# Altium schematic sheet PowerInput.SchDoc
size A; SheetNumber: 2; SheetTotal: 7
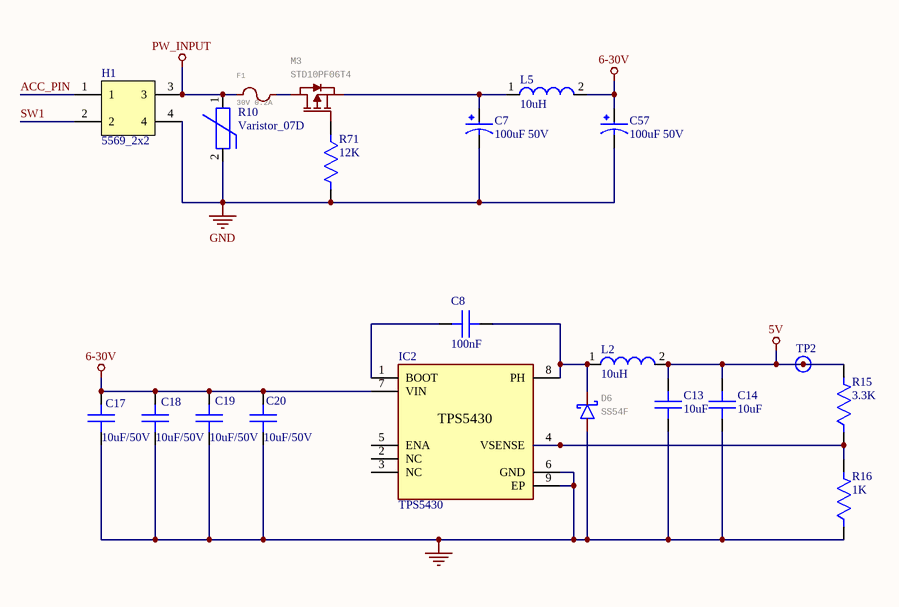
[diagram p0: PowerInput.SchDoc]

## Parts
C7  100uF 50V  [CAP_AL_8x12.5]
C8  100nF  [C0603]
C13  10uF  [C0805]
C14  10uF  [C0805]
C17  10uF/50V  [C0805]
C18  10uF/50V  [C0805]
C19  10uF/50V  [C0805]
C20  10uF/50V  [C0805]
C57  100uF 50V  [CAP_AL_8x12.5]
D6  SS54F  [SMAF]
F1  30V 0.2A  [FUSE_MF-MSMF150]
H1  5569_2x2  [5569_2x2]
IC2  TPS5430  [SOIC-8E]
L2  10uH  [L0630]
L5  10uH  [L0630]
M3  STD10PF06T4  [TO252-3]
R10  Varistor_07D  [Varistor_07D]
R15  3.3K  [R0603]
R16  1K  [R0603]
R71  12K  [R0603]
TP2  TestPoint_1MM  [TestPoint_1MM]  (value not drawn)

## Nets
5V: C13.1 C14.1 L2.2 R15.2 TP2.1
6-30V: C17.1 C18.1 C19.1 C20.1 C57.1 IC2.7(VIN) L5.2
GND: C7.2 C13.2 C14.2 C17.2 C18.2 C19.2 C20.2 C57.2 D6.A H1.4 IC2.6(GND) IC2.9(EP) R10.2 R16.1 R71.2
PW_INPUT: F1.1 H1.3 R10.1
ACC_PIN: H1.1
SW1: H1.2
NetC7_1: C7.1 L5.1 M3.2(S)
NetC8_1: C8.1 IC2.1(BOOT)
NetC8_2: C8.2 D6.C IC2.8(PH) L2.1
NetF1_2: F1.2 M3.3(D)
NetIC2_4: IC2.4(VSENSE) R15.1 R16.2
NetM3_1: M3.1(G) R71.1

Not connected (* = marked no-connect by the designer): IC2 2(NC) 3(NC) 5(ENA)

## Library data of the parts
C7 C57 = CAP_AL_8x12.5: Aluminum Electrolytic Capacitors - Radial Leaded 50VDC 1200uF 10000H 16x25mm; MF: Panasonic; MP: EEU-FS1H122; Price: None; Value: *; Availability: In Stock; Check_prices: https://www.snapeda.com/parts/EEU-FS1H122/Panasonic/view-part/?ref=eda; Purchase-URL: https://pricing.snapeda.com/search/part/EEU-FS1H122/?ref=eda; SnapEDA_Link: https://www.snapeda.com/parts/EEU-FS1H122/Panasonic/view-part/?ref=snap; Package: RADIAL-2 Panasonic
C8 = Capacitor
C13 C14 C17-C20 = Capacitor 0805
D6 = SS54F: GateName_1: G$1; SymbolName_1: DIODE_S; LibraryName: Uy_SMD; DeviceSetName: SS54F; Package: SMAF
F1 = FUSE_MF-MSMF150: GateName_1: G$1; MF: Bourns; SymbolName_1: MF-MSMF150; LibraryName: Uy_SMD; DeviceSetName: MF-MSMF150; Package: FUSER_MF-MSMF150; AVAILABILITY: Unavailable; MP: MF-MSMF150; PACKAGE: None; PRICE: None
IC2 = TPS5430: Buck Step-Down Converter / (5.5V to 36V Input, 3A); MF: Texas Instruments; MP: TPS5430DDA; Availability: Unavailable; Value: *; Mouser-Purchase-URL: https://snapeda.com/shop?store=Mouser&id=226174; Texas_Instruments-Purchase-URL: https://snapeda.com/shop?store=Texas+Instruments&id=226174; Package: HSOIC-8 Texas Instruments; DigiKey-Purchase-URL: https://snapeda.com/shop?store=DigiKey&id=226174; Price: None; SnapEDA_Link: https://www.snapeda.com/parts/TPS5430DDA/Texas%20Instruments/view-part/226174/?ref=snap
L2 L5 = Inductor 0630: HIGH POWER INDUCTOR 1040; MF: Wurth Electronics; MP: 74437368047; Value: *; Price: None; Package: Nonstandard Wurth Electronics; SnapEDA_Link: https://www.snapeda.com/parts/74437368047/Wurth%20Electronics%20Inc./view-part/286863/?ref=snap; Availability: Unavailable
M3 = MOSFETP_TO252: SOT-23; GateName_1: G$1; SymbolName_1: MOSFET_N; DeviceSetName: MOSFETN; LibraryName: Uy_SMD; Package: SOT23(1)
R15 R16 R71 = Resistor 0603: SMD Resistor 0603; Manufacturer: Yageo; Manufacturer Part Number: RC0603FR-071KL; Power Rating: 100mW; Tolerance: 1%; Value: 1kR; Temperature Coefficient: 100ppm/°C; Voltage Rating: 50V; Supplier: Digi-Key; Supplier Part Number: 311-1.00KHRDKR-ND; RoHS: Yes; Category: Chip SMD Resistors; Stock: 18662657; Pricing: 1=0.1, 10=0.018, 50=0.0106, 100=0.0088, 500=0.00592, 1000=0.00505 (USD); Case/Package: 0603; Case Code (Imperial): 0603; Case Code (Metric): 1608; Contact Plating: Tin,Matte; Min Operating Temperature: -55°C; Max Operating Temperature: 155°C; Packaging: Tape and Reel; Resistor Type: Thick Film; Termination: SMD/SMT; Features: Moisture Resistant; Series: RC; Max Power Dissipation: 100mW; Number of Terminations: 2; Resistance Tolerance: 1%; Construction: Rectangular; Technology: THICK FILM; Length: 1.6mm; Height: 0.45mm; Depth: 0.8mm; Reach SVHC Compliant: No; Military Standard: Not; Lead Free: 5697LeadFree; RoHS Compliant: Yes